# EAGLE schematic PiHatTeensy32_40 (EAGLE 9.5.2)
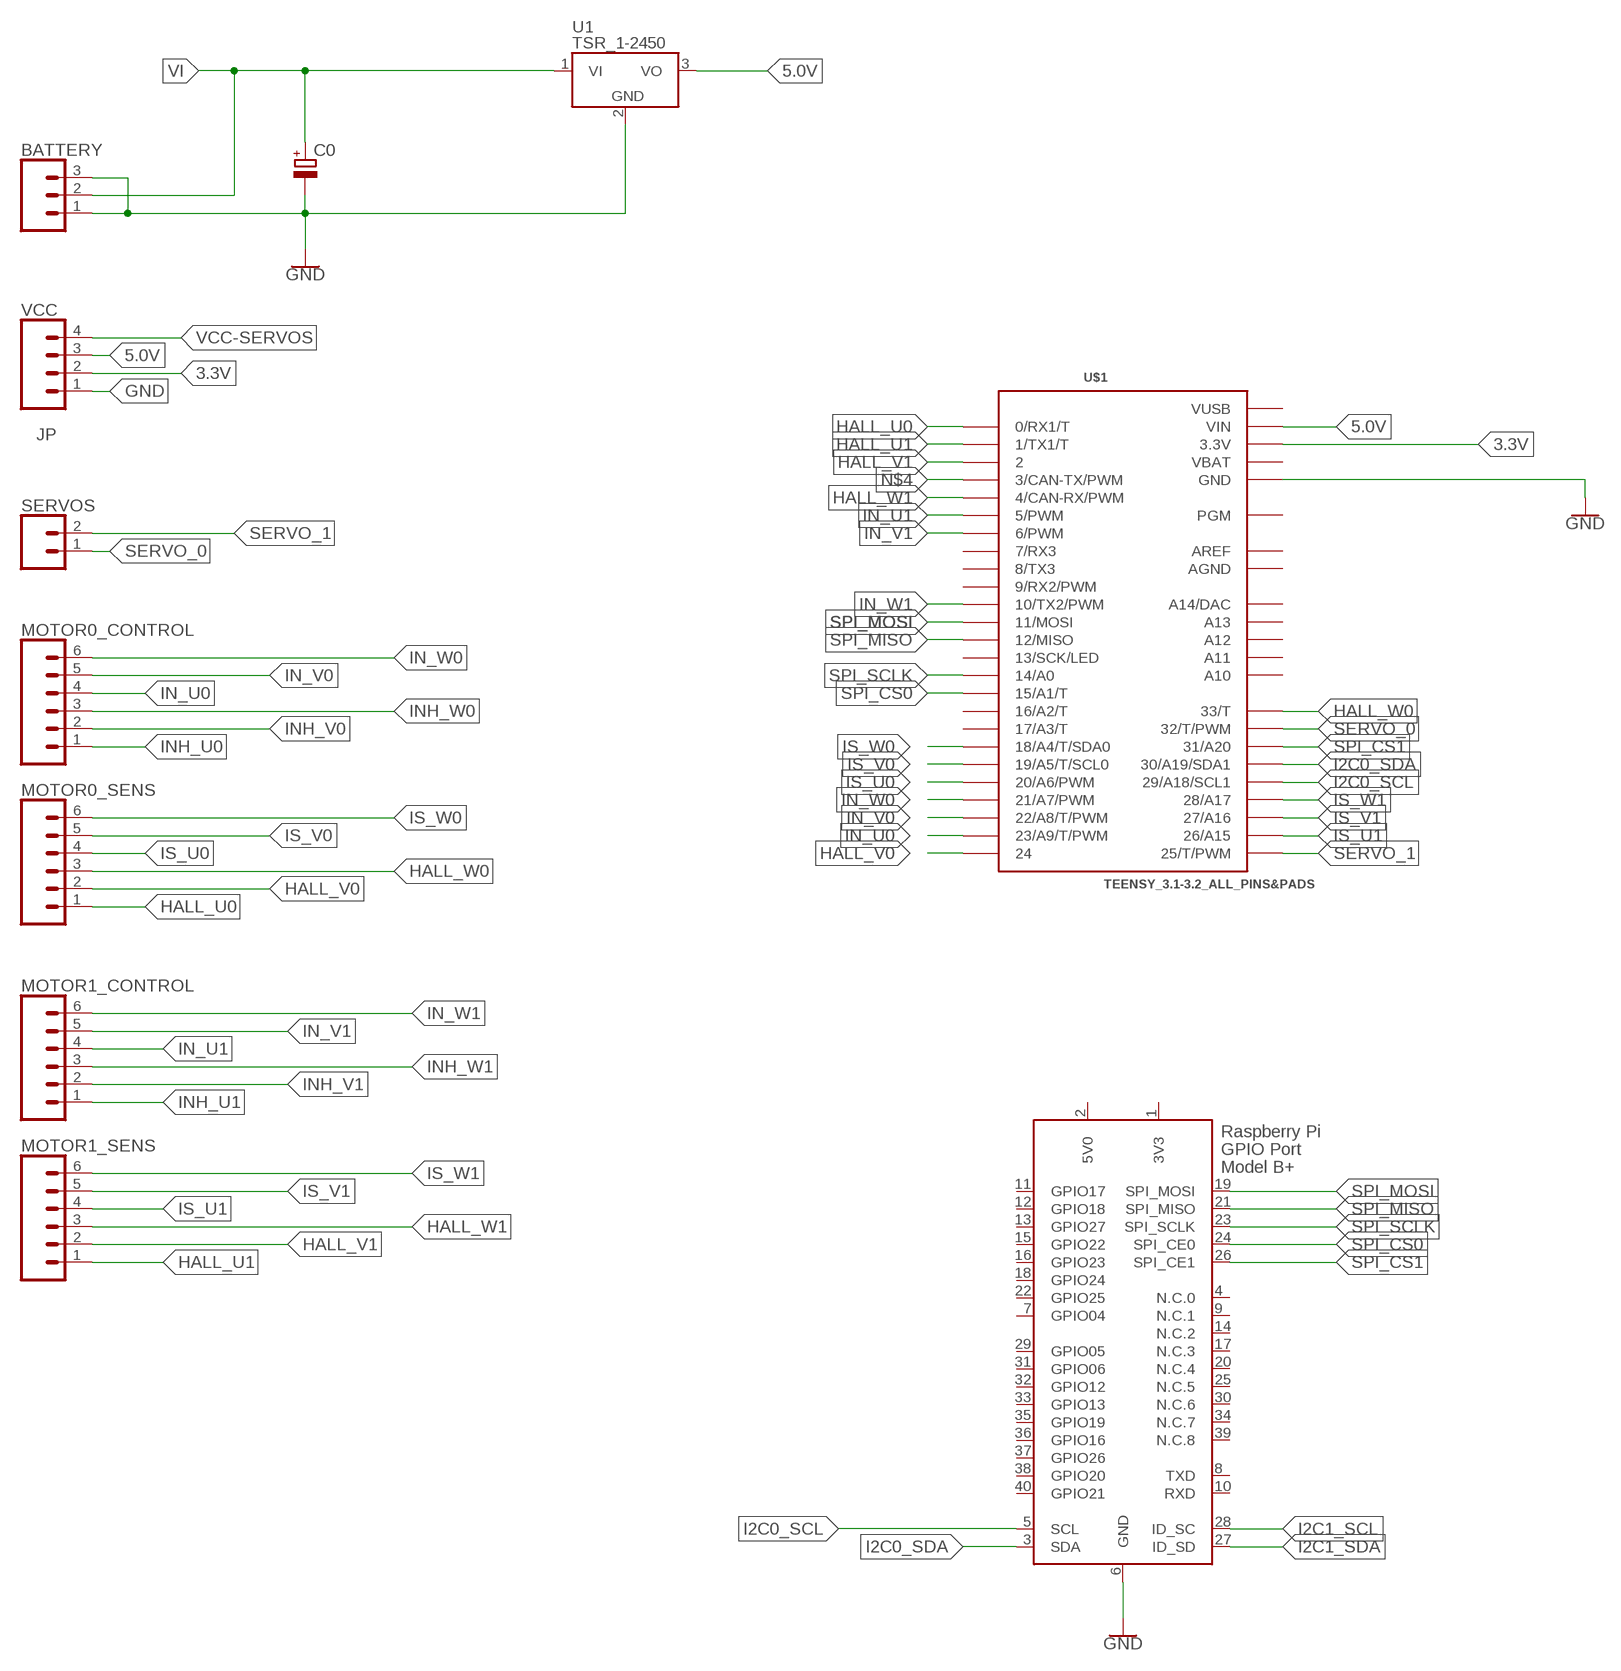
[diagram p0: schematic, sheet 1]

## Parts
BATTERY  CONN_031X03_NO_SILK  [1X03_NO_SILK]
C0  CPOL-EUE2,5-6E  [E2,5-6E]
MOTOR0_CONTROL  CONN_06NO_SILK_NO_POP  [1X06_NO_SILK]
MOTOR0_SENS  CONN_06NO_SILK_NO_POP  [1X06_NO_SILK]
MOTOR1_CONTROL  CONN_06NO_SILK_NO_POP  [1X06_NO_SILK]
MOTOR1_SENS  CONN_06NO_SILK_NO_POP  [1X06_NO_SILK]
SERVOS  CONN_021X02_NO_SILK  [1X02_NO_SILK]
U1  TSR_1-2450  [TSR-1]
U$1  TEENSY_3.1-3.2_ALL_PINS&PADS  [TEENSY_3.0-3.2_ALL_PINS_&_PADS]
VCC  JP  CONN_041X04_NO_SILK  [1X04_NO_SILK]
X1  RASPI_BOARD_B+_H  [RASPI_BOARD_B+HAT]

## Nets
3.3V: U$1.3.3V U$1.3.3V1(3.3V) U$1.3.3V2(3.3V) VCC.2
5.0V: U1.3(VO) U$1.VIN VCC.3
GND: BATTERY.1 BATTERY.3 C0.- U1.2(GND) U$1.GND U$1.GND1(GND) U$1.GND2(GND) VCC.1 X1.6(GND)
HALL_U0: MOTOR0_SENS.1 U$1.0(0/RX1/T)
HALL_U1: MOTOR1_SENS.1 U$1.1(1/TX1/T)
HALL_V0: MOTOR0_SENS.2 U$1.24
HALL_V1: MOTOR1_SENS.2 U$1.2
HALL_W0: MOTOR0_SENS.3 U$1.33(33/T)
HALL_W1: MOTOR1_SENS.3 U$1.4(4/CAN-RX/PWM)
I2C0_SCL: U$1.29(29/A18/SCL1) X1.5(SCL)
I2C0_SDA: U$1.30(30/A19/SDA1) X1.3(SDA)
I2C1_SCL: X1.28(ID_SC)
I2C1_SDA: X1.27(ID_SD)
IN_U0: MOTOR0_CONTROL.4 U$1.23/A9(23/A9/T/PWM)
IN_U1: MOTOR1_CONTROL.4 U$1.5(5/PWM)
IN_V0: MOTOR0_CONTROL.5 U$1.22/A8(22/A8/T/PWM)
IN_V1: MOTOR1_CONTROL.5 U$1.6(6/PWM)
IN_W0: MOTOR0_CONTROL.6 U$1.21/A7(21/A7/PWM)
IN_W1: MOTOR1_CONTROL.6 U$1.10(10/TX2/PWM)
INH_U0: MOTOR0_CONTROL.1
INH_U1: MOTOR1_CONTROL.1
INH_V0: MOTOR0_CONTROL.2
INH_V1: MOTOR1_CONTROL.2
INH_W0: MOTOR0_CONTROL.3
INH_W1: MOTOR1_CONTROL.3
IS_U0: MOTOR0_SENS.4 U$1.20/A6(20/A6/PWM)
IS_U1: MOTOR1_SENS.4 U$1.26(26/A15)
IS_V0: MOTOR0_SENS.5 U$1.19/A5(19/A5/T/SCL0)
IS_V1: MOTOR1_SENS.5 U$1.27(27/A16)
IS_W0: MOTOR0_SENS.6 U$1.18/A4(18/A4/T/SDA0)
IS_W1: MOTOR1_SENS.6 U$1.28(28/A17)
N$4: U$1.3(3/CAN-TX/PWM)
SERVO_0: SERVOS.1 U$1.32(32/T/PWM)
SERVO_1: SERVOS.2 U$1.25(25/T/PWM)
SPI_CS0: U$1.15/A1(15/A1/T) X1.24(SPI_CE0)
SPI_CS1: U$1.31(31/A20) X1.26(SPI_CE1)
SPI_MISO: U$1.12(12/MISO) X1.21(SPI_MISO)
SPI_MOSI: U$1.11(11/MOSI) X1.19(SPI_MOSI)
SPI_SCLK: U$1.14/A0 X1.23(SPI_SCLK)
VCC-SERVOS: VCC.4
VI: BATTERY.2 C0.+ U1.1(VI)
Unconnected: U$1.7(7/RX3) U$1.8(8/TX3) U$1.9(9/RX2/PWM) U$1.13(13/SCK/LED) U$1.16/A2(16/A2/T) U$1.17/A3(17/A3/T) U$1.A10 U$1.A11 U$1.A12 U$1.A13 U$1.PGM U$1.RESET/DAC(A14/DAC) X1.4(N.C.0) X1.7(GPIO04) X1.8(TXD) X1.9(N.C.1) X1.10(RXD) X1.11(GPIO17) X1.12(GPIO18) X1.13(GPIO27) X1.14(N.C.2) X1.15(GPIO22) X1.16(GPIO23) X1.17(N.C.3) X1.18(GPIO24) X1.20(N.C.4) X1.22(GPIO25) X1.25(N.C.5) X1.29(GPIO05) X1.30(N.C.6) X1.31(GPIO06) X1.32(GPIO12) X1.33(GPIO13) X1.34(N.C.7) X1.35(GPIO19) X1.36(GPIO16) X1.37(GPIO26) X1.38(GPIO20) X1.39(N.C.8) X1.40(GPIO21)

## Power pins joined to a net without a drawn wire
3V3: X1.1(3V3)
5V0: X1.2(5V0)
AGND: U$1.AGND
AREF: U$1.AREF
VBAT: U$1.VBAT
VUSB: U$1.VUSB

## Library data of the parts
BATTERY = SparkFun-Connectors:CONN_03: Multi connection point. Often used as Generic Header-pin footprint for 0.1 inch spaced/style header connections On any of the 0.1 inch spaced packages, you can populate with these: Break Away Headers - Straight <https://www.sparkfun.com/products/116> (PRT-00116) Break Away Male Headers - Right Angle <https://www.sparkfun.com/products/553> (PRT-00553) Female Headers <https://www.sparkfun.com/products/115> (PRT-00115) Break Away Headers - Machine Pin <https://www.sparkfun.com/products/117> (PRT-00117) Break Away Female Headers - Swiss Machine Pin <https://www.sparkfun.com/products/743> (PRT-00743) Stackable Header - 3 Pin (Female, 0.1") <https://www.sparkfun.com/products/13875> (PRT-13875) For SCREWTERMINALS and SPRING TERMINALS visit here: Screw Terimnals on SparkFun.com <https://www.sparkfun.com/search/results?term=Screw+Terminals> (5mm/3.5mm/2.54mm spacing) This device is also useful as a general connection point to wire up your design to another part of your project. Our various solder wires solder well into these plated through hole pads. Hook-Up Wire - Assortment (Stranded, 22 AWG) <https://www.sparkfun.com/products/11375> (PRT-11375) Hook-Up Wire - Assortment (Solid Core, 22 AWG) <https://www.sparkfun.com/products/11367> (PRT-11367) View the entire wire category on our website here <https://www.sparkfun.com/categories/141> Special notes: Molex polarized connector foot print use with SKU : PRT-08232 with associated crimp pins and housings.
C0 = rcl:CPOL-EU: POLARIZED CAPACITOR, European symbol; SPICEPREFIX: C
MOTOR0_CONTROL MOTOR0_SENS MOTOR1_CONTROL MOTOR1_SENS = SparkFun-Connectors:CONN_06: Multi connection point. Often used as Generic Header-pin footprint for 0.1 inch spaced/style header connections On any of the 0.1 inch spaced packages, you can populate with these: Break Away Headers - Straight <https://www.sparkfun.com/products/116> (PRT-00116) Break Away Male Headers - Right Angle <https://www.sparkfun.com/products/553> (PRT-00553) Female Headers <https://www.sparkfun.com/products/115> (PRT-00115) Break Away Headers - Machine Pin <https://www.sparkfun.com/products/117> (PRT-00117) Break Away Female Headers - Swiss Machine Pin <https://www.sparkfun.com/products/743> (PRT-00743) Arduino Stackable Header - 6 Pin <https://www.sparkfun.com/products/9280> (PRT-09280) For SCREWTERMINALS and SPRING TERMINALS visit here: Screw Terimnals on SparkFun.com <https://www.sparkfun.com/search/results?term=Screw+Terminals> (5mm/3.5mm/2.54mm spacing) This device is also useful as a general connection point to wire up your design to another part of your project. Our various solder wires solder well into these plated through hole pads. Hook-Up Wire - Assortment (Stranded, 22 AWG) <https://www.sparkfun.com/products/11375> (PRT-11375) Hook-Up Wire - Assortment (Solid Core, 22 AWG) <https://www.sparkfun.com/products/11367> (PRT-11367) View the entire wire category on our website here <https://www.sparkfun.com/categories/141>
SERVOS = SparkFun-Connectors:CONN_02: Multi connection point. Often used as Generic Header-pin footprint for 0.1 inch spaced/style header connections On any of the 0.1 inch spaced packages, you can populate with these: Break Away Headers - Straight <https://www.sparkfun.com/products/116> (PRT-00116) Break Away Male Headers - Right Angle <https://www.sparkfun.com/products/553> (PRT-00553) Female Headers <https://www.sparkfun.com/products/115> (PRT-00115) Break Away Headers - Machine Pin <https://www.sparkfun.com/products/117> (PRT-00117) Break Away Female Headers - Swiss Machine Pin <https://www.sparkfun.com/products/743> (PRT-00743) For SCREWTERMINALS and SPRING TERMINALS visit here: Screw Terimnals on SparkFun.com <https://www.sparkfun.com/search/results?term=Screw+Terminals> (5mm/3.5mm/2.54mm spacing) This device is also useful as a general connection point to wire up your design to another part of your project. Our various solder wires solder well into these plated through hole pads. Hook-Up Wire - Assortment (Stranded, 22 AWG) <https://www.sparkfun.com/products/11375> (PRT-11375) Hook-Up Wire - Assortment (Solid Core, 22 AWG) <https://www.sparkfun.com/products/11367> (PRT-11367) View the entire wire category on our website here <https://www.sparkfun.com/categories/141> Special notes: Molex polarized connector foot print use with: PRT-08233 with associated crimp pins and housings. 2.54_SCREWTERM for use with PRT-10571. 3.5mm Screw Terminal footprints for PRT-08084 5mm Screw Terminal footprints for use with PRT-08432
U1 = _traco_tsr-1:TSR_1-*: TRACO TSR-1 Series Point-of-Load DC/DC-Converters Vi max. 36 V; Vo = (1.2 .. 15)V ±2%; Io = 0 .. 1 A SIP-Package (drop-in replacement for 78xx linear voltage regulators in TO220-package, vertically assembled) Source: www.tracopower.com Technologies: TSR 1- Vi (V) Vo (V) ±2% Io = 0 .. 1 A 24_ ( generic ) 2412 4.6 .. 36 1.2 2415 4.6 .. 36 1.5 2418 4.6 .. 36 1.8 2425 4.6 .. 36 2.5 2433 4.75.. 36 3.3 2450 6.5 .. 36 5.0 2465 9.0 .. 36 6.5 2490 12 .. 36 9.0 24120 15 .. 36 12 24150 18 .. 36 15 Author: Dipl.-Ing. FH Rainer Bayer HHN Hochschule Heilbronn, rainer.bayer@hs-heilbronn.de Ingenieurbüro ing-rb, mail@ing-rb.de
U$1 = Teensy_3_and_LC_Series_Boards_v1.4:TEENSY_3.1-3.2_ALL_PINS&PADS: Footprint for Teensy 3.1 or 3.2 board using all pads and all through-holes. Pads need a 2x7 0.1" SMD header.
VCC = SparkFun-Connectors:CONN_04: Multi connection point. Often used as Generic Header-pin footprint for 0.1 inch spaced/style header connections On any of the 0.1 inch spaced packages, you can populate with these: Break Away Headers - Straight <https://www.sparkfun.com/products/116> (PRT-00116) Break Away Male Headers - Right Angle <https://www.sparkfun.com/products/553> (PRT-00553) Female Headers <https://www.sparkfun.com/products/115> (PRT-00115) Break Away Headers - Machine Pin <https://www.sparkfun.com/products/117> (PRT-00117) Break Away Female Headers - Swiss Machine Pin <https://www.sparkfun.com/products/743> (PRT-00743) For SCREWTERMINALS and SPRING TERMINALS visit here: Screw Terimnals on SparkFun.com <https://www.sparkfun.com/search/results?term=Screw+Terminals> (5mm/3.5mm/2.54mm spacing) This device is also useful as a general connection point to wire up your design to another part of your project. Our various solder wires solder well into these plated through hole pads. Hook-Up Wire - Assortment (Stranded, 22 AWG) <https://www.sparkfun.com/products/11375> (PRT-11375) Hook-Up Wire - Assortment (Solid Core, 22 AWG) <https://www.sparkfun.com/products/11367> (PRT-11367) View the entire wire category on our website here <https://www.sparkfun.com/categories/141> Special notes: Molex polarized connector foot print use with SKU : PRT-08231 with associated crimp pins and housings. 1MM SMD Version SKU: PRT-10208; PROD_ID: CONN-09696
X1 = raspberrypi_bastelstube_v13:RASPI_BOARD_B+: Raspberry Pi GPIO connector with markings for the outer dimensions of the Raspberry Pi board model B+ with different sets of drill holes or mounting pads